# EasyEDA Pro project Xbee_v1.eprj

# Schematic Schematic1

## Sheets
1 Xbee: Board Name: Board1; Create Date: 2024-11-14; Page Name: Xbee; Project Name: Xbee; Schematic Name: Schematic1; Update Date: 2024-11-23; Company: EasyEDA.com; Drawn: EasyEDA; Page Size: A4; Part Number: JLCPCB-002; Reviewed: EasyEDA; Version: V0.1
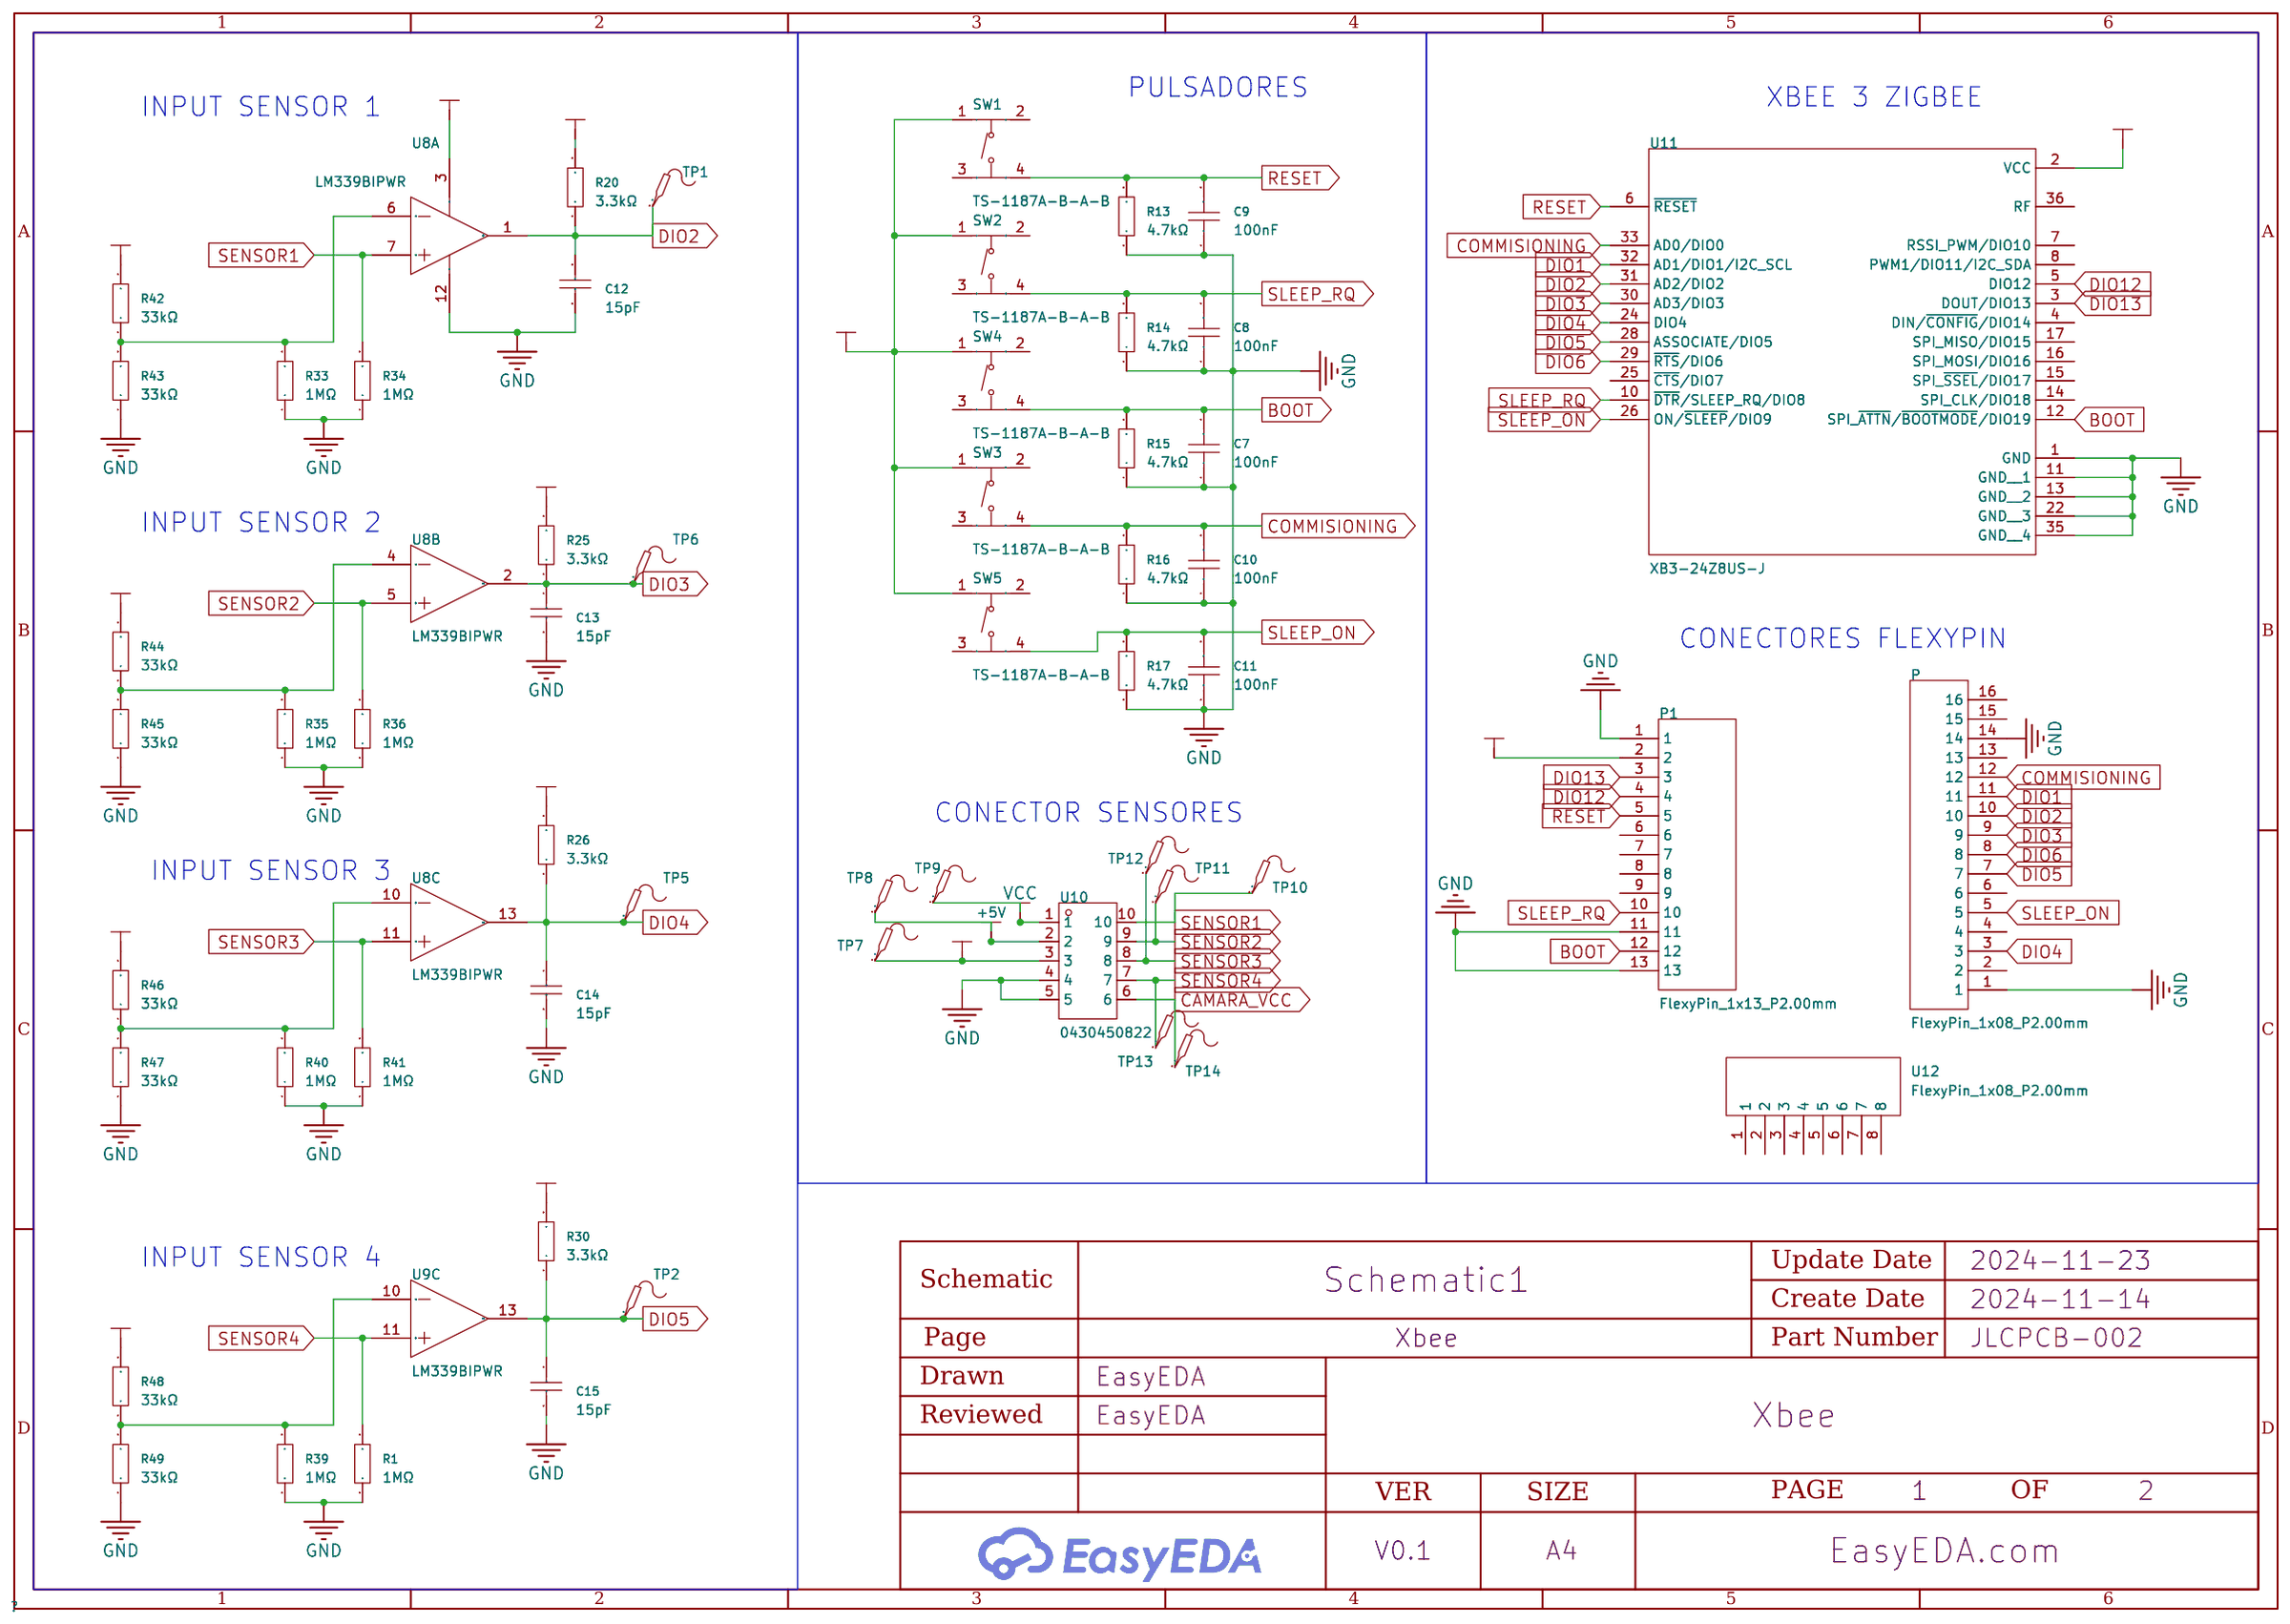
[diagram p0: Xbee]
2 Power: Create Date: 2024-11-18; Page Name: Power
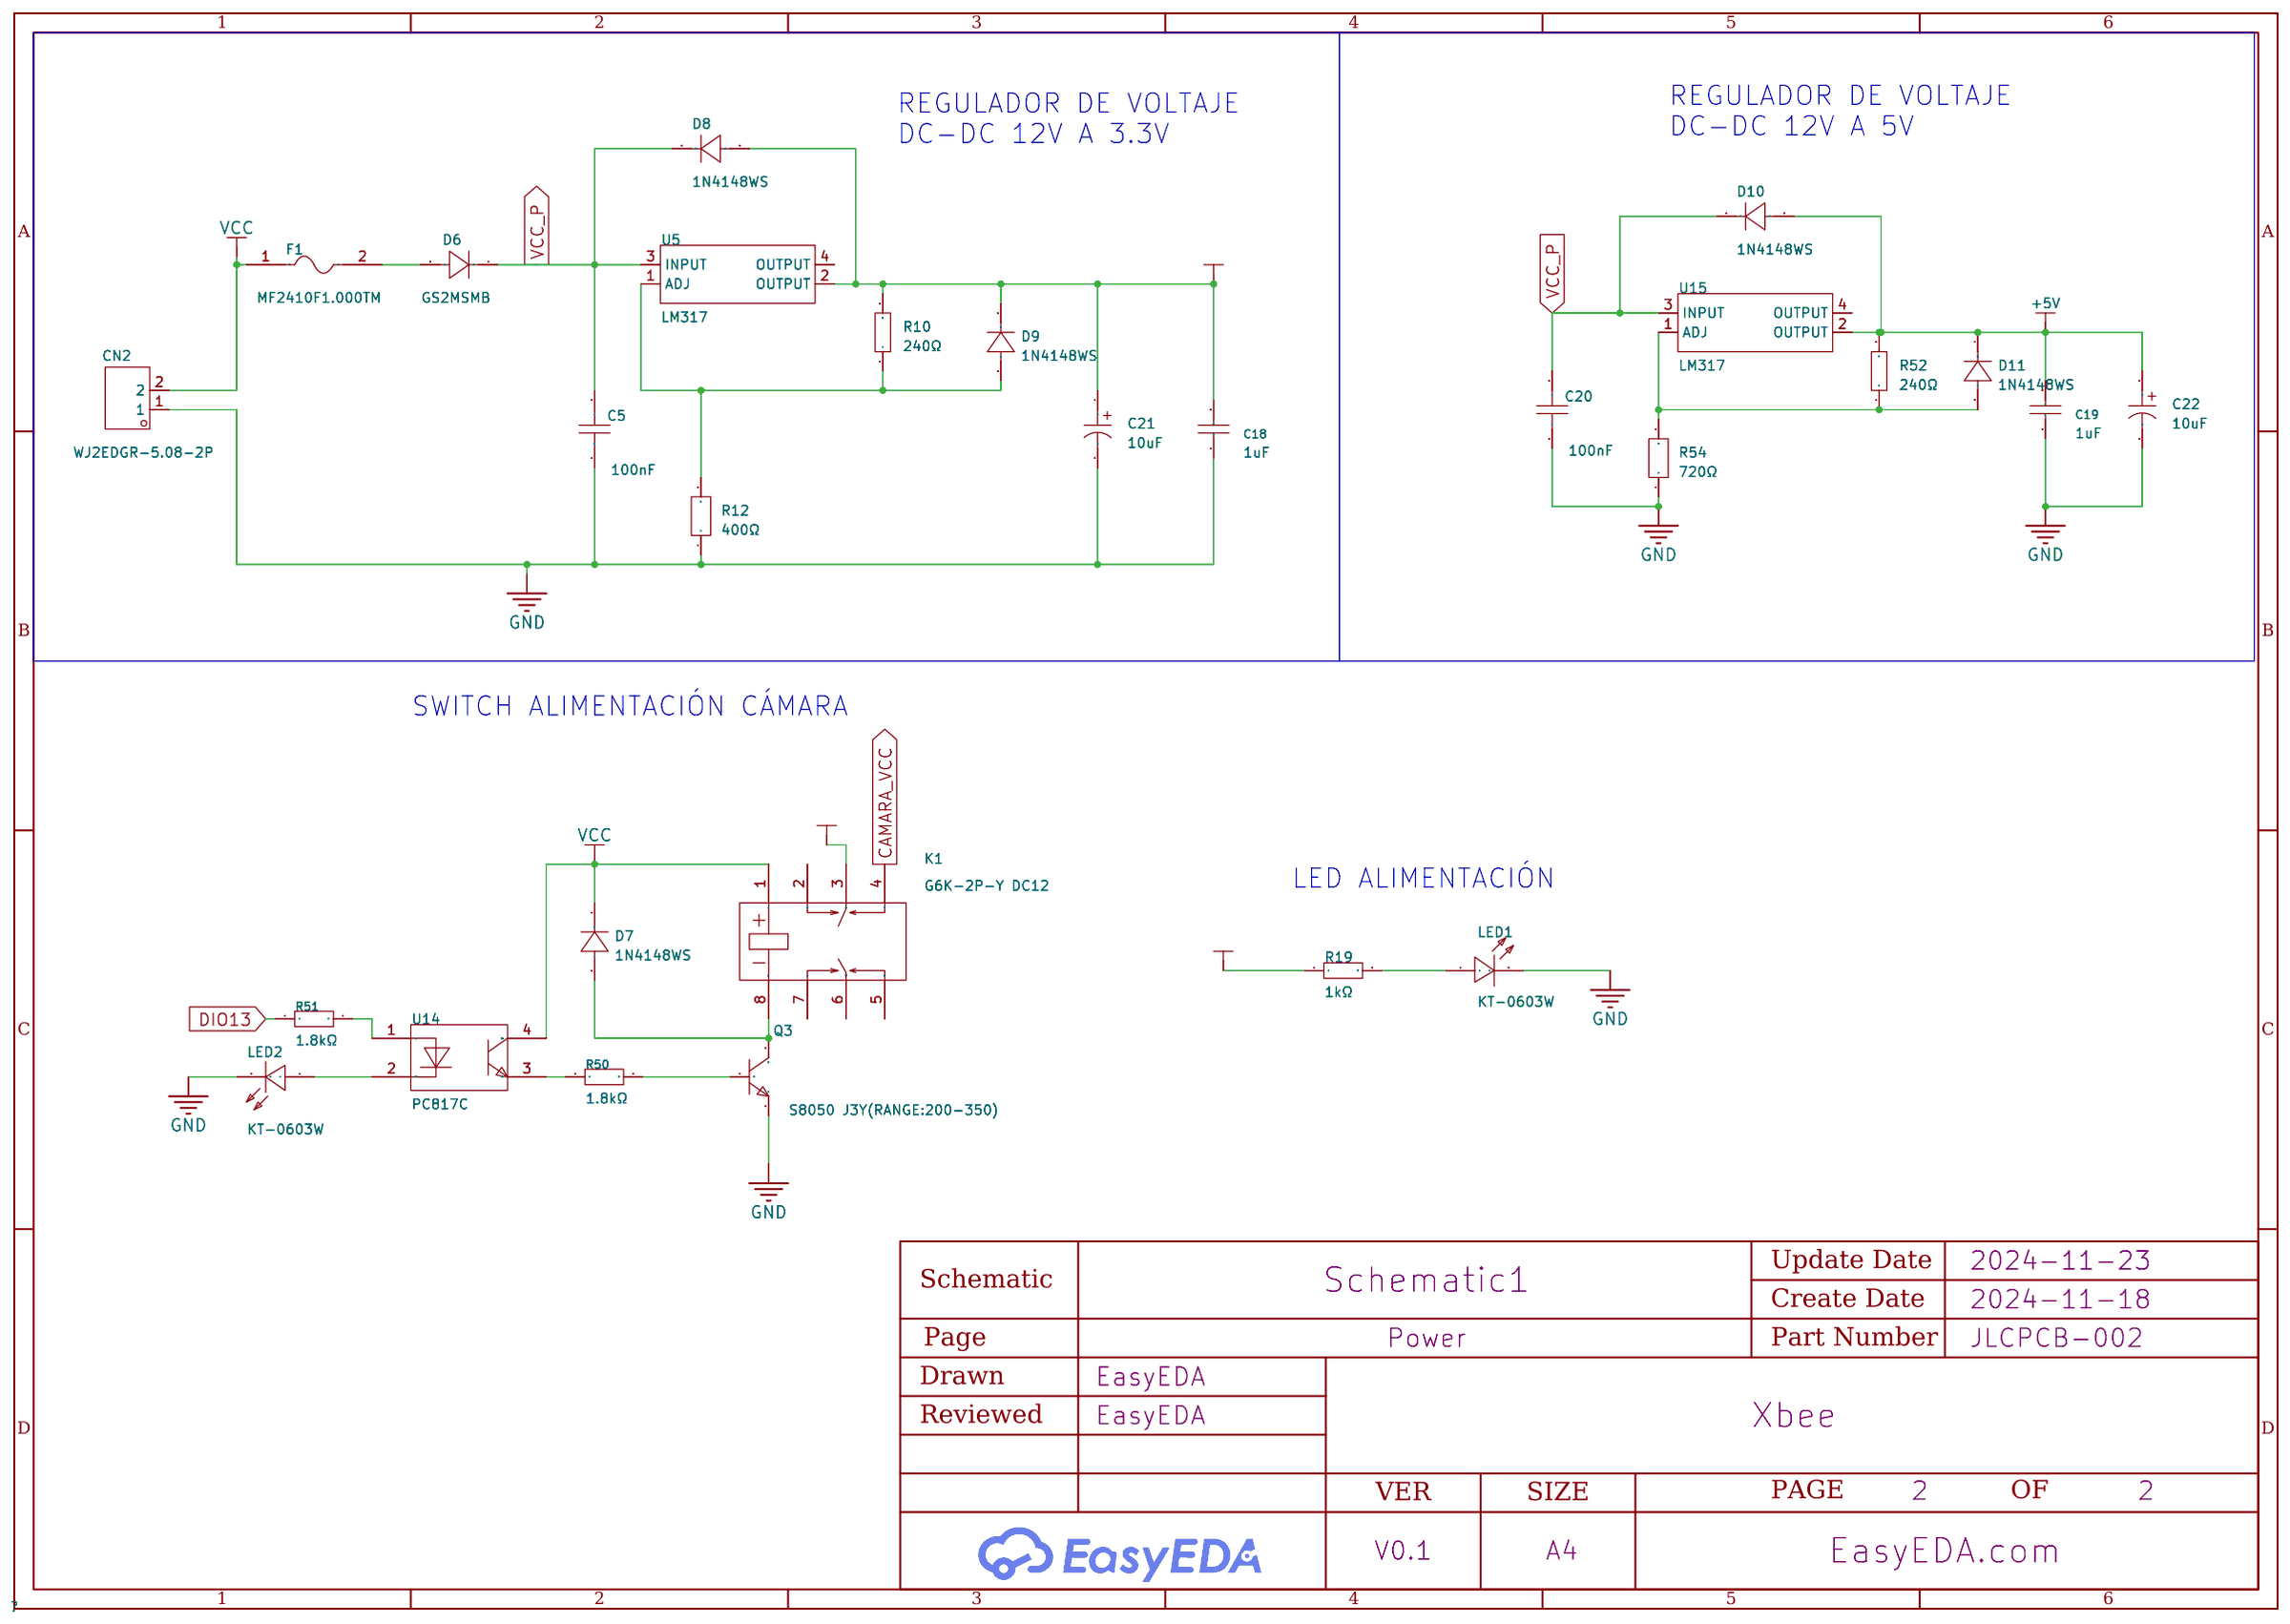
[diagram p1: Power]

## Parts
sheet Power
C5  100nF  [C0603]
C18  1uF  [C0402]
C19  1uF  [C0402]
C20  100nF  [C0603]
C21  10uF  [CAP-TH_BD5.0-P2.00-D0.6-FD]
C22  10uF  [CAP-TH_BD5.0-P2.00-D0.6-FD]
CN2  WJ2EDGR-5.08-2P  [CONN-TH_WJ2EDGR-5.08-2P]
D6  GS2MSMB  [SMB_L4.6-W3.5-LS5.3-RD]
D7  1N4148WS  [SOD-323_L1.8-W1.3-LS2.5-RD]
D8  1N4148WS  [SOD-323_L1.8-W1.3-LS2.5-RD]
D9  1N4148WS  [SOD-323_L1.8-W1.3-LS2.5-RD]
D10  1N4148WS  [SOD-323_L1.8-W1.3-LS2.5-RD]
D11  1N4148WS  [SOD-323_L1.8-W1.3-LS2.5-RD]
F1  MF2410F1.000TM  [F2410]
K1  G6K-2P-Y DC12  [RELAY-TH_6S-2-4.5VG6K-2P-Y-12V]
LED1  KT-0603W  [LED0603-R-RD_WHITE]
LED2  KT-0603W  [LED0603-R-RD_WHITE]
Q3  S8050 J3Y(RANGE:200-350)  [SOT-23-3_L3.0-W1.7-P0.95-LS2.9-BR]
R10  240Ω  [R0402]
R12  400Ω  [R1206]
R19  1kΩ  [R0603]
R50  1.8kΩ  [R0402]
R51  1.8kΩ  [R0402]
R52  240Ω  [R0402]
R54  720Ω  [R0805]
U5  LM317  [SOT-223-3_L6.7-W3.7-P2.30-LS7.0-BR]
U14  PC817C  [SMD-4_L6.5-W4.6-P2.54-LS10.3-TL]
U15  LM317  [SOT-223-3_L6.7-W3.7-P2.30-LS7.0-BR]
sheet Xbee
C7  100nF  [C0603]  (no BOM)
C8  100nF  [C0603]  (no BOM)
C9  100nF  [C0603]  (no BOM)
C10  100nF  [C0603]  (no BOM)
C11  100nF  [C0603]  (no BOM)
C12  15pF  [C0603]
C13  15pF  [C0603]
C14  15pF  [C0603]
C15  15pF  [C0603]
P  FlexyPin_1x08_P2.00mm  [FlexyPin_1x16_P2.00mm]
P1  FlexyPin_1x13_P2.00mm  [FlexyPin_1x13_P2.00mm]
R1  1MΩ  [R1206]
R13  4.7kΩ  [R0805]  (no BOM)
R14  4.7kΩ  [R0805]  (no BOM)
R15  4.7kΩ  [R0805]  (no BOM)
R16  4.7kΩ  [R0805]  (no BOM)
R17  4.7kΩ  [R0805]  (no BOM)
R20  3.3kΩ  [R0603]
R25  3.3kΩ  [R0603]
R26  3.3kΩ  [R0603]
R30  3.3kΩ  [R0603]
R33  1MΩ  [R1206]
R34  1MΩ  [R1206]
R35  1MΩ  [R1206]
R36  1MΩ  [R1206]
R39  1MΩ  [R1206]
R40  1MΩ  [R1206]
R41  1MΩ  [R1206]
R42  33kΩ  [R0603]
R43  33kΩ  [R0603]
R44  33kΩ  [R0603]
R45  33kΩ  [R0603]
R46  33kΩ  [R0603]
R47  33kΩ  [R0603]
R48  33kΩ  [R0603]
R49  33kΩ  [R0603]
SW1  TS-1187A-B-A-B  [SW-SMD_4P-L5.1-W5.1-P3.70-LS6.5-TL_H1.5]  (no BOM)
SW2  TS-1187A-B-A-B  [SW-SMD_4P-L5.1-W5.1-P3.70-LS6.5-TL_H1.5]  (no BOM)
SW3  TS-1187A-B-A-B  [SW-SMD_4P-L5.1-W5.1-P3.70-LS6.5-TL_H1.5]  (no BOM)
SW4  TS-1187A-B-A-B  [SW-SMD_4P-L5.1-W5.1-P3.70-LS6.5-TL_H1.5]  (no BOM)
SW5  TS-1187A-B-A-B  [SW-SMD_4P-L5.1-W5.1-P3.70-LS6.5-TL_H1.5]  (no BOM)
TP1  -  [Test-Point-0.5mm]
TP2  -  [Test-Point-0.5mm]
TP5  -  [Test-Point-0.5mm]
TP6  -  [Test-Point-0.5mm]
TP7  -  [Test-Point-0.5mm]
TP8  -  [Test-Point-0.5mm]
TP9  -  [Test-Point-0.5mm]
TP10  -  [Test-Point-0.5mm]
TP11  -  [Test-Point-0.5mm]
TP12  -  [Test-Point-0.5mm]
TP13  -  [Test-Point-0.5mm]
TP14  -  [Test-Point-0.5mm]
U8  LM339BIPWR  [TSSOP-14_L5.0-W4.4-P0.65-LS6.4-BL]  (sections 1,2,3)
U9  LM339BIPWR  [TSSOP-14_L5.0-W4.4-P0.65-LS6.4-BL]  (section 3)
U10  0430450822  [CONN-TH_0430450822]
U11  XB3-24Z8US-J  [XCVR_XB3-24Z8US-J]  (no BOM)
U12  FlexyPin_1x08_P2.00mm  [FlexyPin_1x08_P2.00mm]

## Library data of the parts
C5 C20 = CC0603KRX7R9BB104: Capacitance: Tolerance:±10% Tolerance:±10% Voltage Rated: Temperature Coefficient:; LCSC Part Name: 100nF ±10% 50V; Supplier Part: C14663; Manufacturer: YAGEO(国巨); Supplier Footprint: 0603; JLCPCB Part Class: Basic Part; Datasheet: https://atta.szlcsc.com/upload/public/pdf/source/20180910/C282072_33301C7F631E79921B82A8DAC6BCC5B3.pdf; Supplier: LCSC; Tolerance: ±10%; Check: true
C18 C19 = CL05A105KP5NNNC: LCSC Part Name: 1uF ±10% 10V; Supplier Part: C14445; Manufacturer: SAMSUNG(三星); Supplier Footprint: 0402; JLCPCB Part Class: Extended Part; Datasheet: https://atta.szlcsc.com/upload/public/pdf/source/20160218/1457707763339.pdf; Supplier: LCSC; Tolerance: ±10%
C21 C22 = 50V10uF CD110: LCSC Part Name: 10uF ±20% 50V; Supplier Part: C2960200; Manufacturer: HRK(鸿瑞凯电子); Supplier Footprint: 插件,D5xL7mm; JLCPCB Part Class: Extended Part; Datasheet: https://atta.szlcsc.com/upload/public/pdf/source/20220224/E11F40A390421459FFAC7D4A6BAF4847.pdf; Supplier: LCSC; Tolerance: ±20%; Operating Temperature: -40℃~+105℃
CN2 = WJ2EDGR-5.08-2P: LCSC Part Name: 1x2P 5.08mm 排数:1 每排P数:2; Supplier Part: C8383; Manufacturer: KANGNEX(康奈克斯电气); Supplier Footprint: 弯插,P=5.08mm; JLCPCB Part Class: Extended Part; Datasheet: https://atta.szlcsc.com/upload/public/pdf/source/20191225/C8383_DE80ABD4B75356B45B295FA186A21D08.pdf; Supplier: LCSC; Connector Type: Board end/socket - Open type; Structure: 1x2P; Pitch: 5.08mm; Color: Green; Mounting Style: Bend; Number of Pins: 2P; Number of Rows: 1; Number of PINs Per Row: 2; Current Rating (Max): 20A; Voltage Rating (Max): 450V; Contact Material: Brass; Contact Plating: Tin; Operating Temperature Range: -40℃~+105℃; Check: true
D6 = GS2MSMB: LCSC Part Name: 电压:1kV 电流:2A; Supplier Part: C2972763; Manufacturer: JKSEMI(金开盛); Supplier Footprint: SMB; JLCPCB Part Class: Extended Part; Datasheet: https://atta.szlcsc.com/upload/public/pdf/source/20220309/99C0AE0C19ED4A75EB02FB7BED855B59.pdf; Supplier: LCSC; Forward Voltage (Vf@If): 1.1V@2A; Check: true
D7-D11 = 1N4148WS_C917117: LCSC Part Name: 电压:100V 电流:300mA; Supplier Part: C917117; Manufacturer: JSMSEMI(杰盛微); Supplier Footprint: SOD-323; JLCPCB Part Class: Extended Part; Datasheet: https://atta.szlcsc.com/upload/public/pdf/source/20230807/08D9F448A82EA88A23B325A669586A09.pdf; Supplier: LCSC; Forward Voltage (Vf@If): 1.25V@150mA; Reverse Leakage Current: 1uA@75V; Operating Temperature: -55℃~+150℃@(Tj)
F1 = MF2410F1.000TM: LCSC Part Name: 250V贴片式保险丝; Supplier Part: C83798; Manufacturer: AEM; Supplier Footprint: SMD; JLCPCB Part Class: Extended Part; Datasheet: https://atta.szlcsc.com/upload/public/pdf/source/20200908/C83798_396F0CF7AA83E8B3AAA489356853D9D1.pdf; Supplier: LCSC; Type: SMD Fuse; Current Rating: 1A; Voltage Rating  (AC): 250V; Operating Temperature: -55℃~+125℃; Breaking Capacity: 100A
K1 = G6K-2P-Y DC12: LCSC Part Name: G6K-2P-Y-12V; Supplier Part: C132367; Manufacturer: OMRON(欧姆龙); Supplier Footprint: DIP,6.5x10mm; JLCPCB Part Class: Extended Part; Datasheet: https://atta.szlcsc.com/upload/public/pdf/source/20220125/C1876770_53E5491D4B68F29C4BBD8118E9BAE0E8.pdf; Supplier: LCSC; Coil Voltage: 12V; Contact Form: 两组转换:2C(DPDT-转换); Maximum Switching Voltage: 125V@AC；60V@DC; Contact Material: silver+Gold plating; Maximum Switching Current: 1A; Operate Time: 3ms; Release Time: 3ms; Operating Temperature: -40℃~+70℃
LED1 LED2 = KT-0603W: LCSC Part Name: 0603 白灯 高亮; Supplier Part: C2290; Manufacturer: KENTO; Supplier Footprint: 0603; JLCPCB Part Class: Basic Part; Datasheet: https://atta.szlcsc.com/upload/public/pdf/source/20221101/4C23D5C85BA051E44A00B833D0A41468.pdf; Supplier: LCSC; Emitted Color: White
Q3 = S8050 J3Y(RANGE:200-350): LCSC Part Name: NPN 电流:500mA 耐压:25V H档(200-350); Supplier Part: C2146; Manufacturer: CJ(江苏长电/长晶); Supplier Footprint: SOT-23; JLCPCB Part Class: Basic Part; Datasheet: https://atta.szlcsc.com/upload/public/pdf/source/20231013/FF37B6A000E6CDA75C9C999D2E78731F.pdf; Supplier: LCSC; DC Current Gain (hFE@Ic,Vce): 200@500mA,1V; Transition Frequency (fT): 150MHz; Collector Cut-Off Current (Icbo): 100nA; Collector-Emitter Saturation Voltage (VCE(sat)@Ic,Ib): 600mV@500mA,50mA; Operating Temperature: -55℃~+150℃
R10 R52 = RC0402FR-07240RL: LCSC Part Name: 厚膜电阻 240Ω ±1% 62.5mW; Supplier Part: C114755; Manufacturer: YAGEO(国巨); Supplier Footprint: 0402; JLCPCB Part Class: Extended Part; Datasheet: https://atta.szlcsc.com/upload/public/pdf/source/20180821/C275644_0D56F95EFF785E7D9A1FEF436B37DA78.pdf; Supplier: LCSC; Type: Thick Film Resistors; Tolerance: ±1%; Temperature Coefficient: ±100ppm/℃; Operating Temperature Range: -55℃~+155℃; Check: true
R12 = RT1206BRD07400RL: LCSC Part Name: 薄膜电阻 400Ω ±0.1% 250mW; Supplier Part: C706413; Manufacturer: YAGEO(国巨); Supplier Footprint: 1206; JLCPCB Part Class: Extended Part; Datasheet: https://atta.szlcsc.com/upload/public/pdf/source/20200720/C706413_991262FD379FFE926945677BBC00C1EC.pdf; Supplier: LCSC; Type: Thin Film Resistor; Tolerance: ±0.1%; Power(Watts): 250mW; Temperature Coefficient: ±25ppm/℃; Operating Temperature Range: -55℃~+155℃; Check: true
R19 = 0603WAF1001T5E: LCSC Part Name: 1kΩ ±1% 100mW 厚膜电阻; Supplier Part: C21190; Manufacturer: UNI-ROYAL(厚声); Supplier Footprint: 0603; JLCPCB Part Class: Basic Part; Datasheet: https://atta.szlcsc.com/upload/public/pdf/source/20200306/C422600_1E6D84923E4A46A82E41ADD87F860B5C.pdf; Supplier: LCSC; Type: Thick Film Resistors; Tolerance: ±1%; Temperature Coefficient: ±100ppm/℃; Operating Temperature Range: -55℃~+155℃
R50 R51 = 0402WGF1801TCE: LCSC Part Name: 1.8kΩ ±1% 62.5mW 厚膜电阻; Supplier Part: C25871; Manufacturer: UNI-ROYAL(厚声); Supplier Footprint: 0402; JLCPCB Part Class: Extended Part; Datasheet: https://atta.szlcsc.com/upload/public/pdf/source/20200306/C422600_1E6D84923E4A46A82E41ADD87F860B5C.pdf; Supplier: LCSC; Type: Thick Film Resistors; Tolerance: ±1%; Temperature Coefficient: ±100ppm/℃; Operating Temperature Range: -55℃~+155℃
R54 = Y1624720R000T9W: LCSC Part Name: 720Ω ±0.01% 200mW; Supplier Part: C4071481; Manufacturer: VISHAY(威世); Supplier Footprint: 0805; JLCPCB Part Class: Extended Part; Supplier: LCSC; Tolerance: ±0.01%; Temperature Coefficient: ±0.2ppm/℃; Operating Temperature Range: -55℃~+150℃
U5 U15 = LM317_C7543014: LCSC Part Name: ADJ 输入40V 输出1.2V~37V 1.5A; Supplier Part: C7543014; Manufacturer: HXY MOSFET(华轩阳电子); Supplier Footprint: SOT-223; JLCPCB Part Class: Extended Part; Datasheet: https://atta.szlcsc.com/upload/public/pdf/source/20240523/5EE7B31F0BBF1ABA5627560C7CA7F030.pdf; Supplier: LCSC; Output Type: 可调; Maximum Input Voltage: 40V; Output Voltage: 1.2V~37V; MAX Output Current: 2.2A; Output Polarity: Positive electrode; Number of Outputs: 1; Check: true
U14 = PC817C_C5451663: LCSC Part Name: 光电晶体管输出 C档 C档; Supplier Part: C5451663; Manufacturer: HXY MOSFET(华轩阳电子); Supplier Footprint: SMD-4; JLCPCB Part Class: Extended Part; Datasheet: https://atta.szlcsc.com/upload/public/pdf/source/20230427/2D3E47F01143E2C21095E32F53157FE2.pdf; Supplier: LCSC; Input voltage type: DC; Output Type: 光电三极管; Forward Voltage: 1.2V; Output Current: 50mA; Reverse Voltage: 6V; Receiving End Voltage: 35V; Number of Outputs: 1; Collector-Emitter Saturation Voltage (Vce(sat)@Ic,IF): 200mV; Rise time: 18us; Fall time: 18us
C7-C11 = CC0603KRX7R9BB104: LCSC Part Name: 100nF ±10% 50V; Supplier Part: C14663; Manufacturer: YAGEO(国巨); Supplier Footprint: 0603; JLCPCB Part Class: Basic Part; Datasheet: https://atta.szlcsc.com/upload/public/pdf/source/20180910/C282072_33301C7F631E79921B82A8DAC6BCC5B3.pdf; Supplier: LCSC; Tolerance: ±10%; Check: true
C12-C15 = CC0603JRNPO9BN150: LCSC Part Name: 15pF ±5% 50V; Supplier Part: C107037; Manufacturer: YAGEO(国巨); Supplier Footprint: 0603; JLCPCB Part Class: Extended Part; Datasheet: https://atta.szlcsc.com/upload/public/pdf/source/20170914/C128857_1505359892143968080.pdf; Supplier: LCSC; Tolerance: ±5%
P = FlexyPin_1x16_P2.00mm: Check: false
P1 = FlexyPin_1x13_P2.00mm: Check: false
R1 R33-R36 R39-R41 = 1206W4F1004T5E: LCSC Part Name: 1MΩ ±1% 250mW 厚膜电阻; Supplier Part: C17927; Manufacturer: UNI-ROYAL(厚声); Supplier Footprint: 1206; JLCPCB Part Class: Basic Part; Datasheet: https://atta.szlcsc.com/upload/public/pdf/source/20200306/C422600_1E6D84923E4A46A82E41ADD87F860B5C.pdf; Supplier: LCSC; Type: Thick Film Resistors; Tolerance: ±1%; Temperature Coefficient: ±100ppm/℃; Operating Temperature Range: -55℃~+155℃
R13-R17 = 0805W8F4701T5E: LCSC Part Name: 4.7kΩ ±1% 125mW 厚膜电阻; Supplier Part: C17673; Manufacturer: UNI-ROYAL(厚声); Supplier Footprint: 0805; JLCPCB Part Class: Basic Part; Datasheet: https://atta.szlcsc.com/upload/public/pdf/source/20200306/C422600_1E6D84923E4A46A82E41ADD87F860B5C.pdf; Supplier: LCSC; Type: Thick Film Resistors; Tolerance: ±1%; Temperature Coefficient: ±100ppm/℃; Operating Temperature Range: -55℃~+155℃
R20 R25 R26 R30 = 0603WAF3301T5E: LCSC Part Name: 3.3kΩ ±1% 100mW 厚膜电阻; Supplier Part: C22978; Manufacturer: UNI-ROYAL(厚声); Supplier Footprint: 0603; JLCPCB Part Class: Basic Part; Datasheet: https://atta.szlcsc.com/upload/public/pdf/source/20200306/C422600_1E6D84923E4A46A82E41ADD87F860B5C.pdf; Supplier: LCSC; Type: Thick Film Resistors; Tolerance: ±1%; Temperature Coefficient: ±100ppm/℃; Operating Temperature Range: -55℃~+155℃
R42-R49 = 0603WAF3302T5E: LCSC Part Name: 33kΩ ±1% 100mW 厚膜电阻; Supplier Part: C4216; Manufacturer: UNI-ROYAL(厚声); Supplier Footprint: 0603; JLCPCB Part Class: Basic Part; Datasheet: https://atta.szlcsc.com/upload/public/pdf/source/20200306/C422600_1E6D84923E4A46A82E41ADD87F860B5C.pdf; Supplier: LCSC; Type: Thick Film Resistors; Tolerance: ±1%; Temperature Coefficient: ±100ppm/℃; Operating Temperature Range: -55℃~+155℃
SW1-SW5 = TS-1187A-B-A-B: LCSC Part Name: 5.1*5.1*1.5mm 立贴 轻触开关; Supplier Part: C318884; Manufacturer: XKB Connectivity(中国星坤); Supplier Footprint: SMD; JLCPCB Part Class: Basic Part; Datasheet: https://atta.szlcsc.com/upload/public/pdf/source/20200227/C318890_053E50208A88A7BA1965D8746000774E.pdf; Supplier: LCSC; Circuit: SPST; Actuator Style: Round Button; Operating Force: 160gf; Mounting Style: Brick nogging; Switch Length: 5.1mm; Switch Width: 5.1mm; Switch Height: 1.5mm; Strike Gundam: 不带; Contact Current: 50mA; Voltage Rating (DC): 12V; Actuator/Cap Color: 金色; With Lamp: No; Mechanical Life: 10万次; Operating Temperature: -30℃~+85℃; Check: true
TP1 TP2 TP5-TP14 = Test-Point: Check: false
U8 U9 = LM339BIPWR: Supplier Part: C7430196; Manufacturer: TI(德州仪器); Supplier Footprint: TSSOP-14; JLCPCB Part Class: Extended Part; Datasheet: https://atta.szlcsc.com/upload/public/pdf/source/20230810/1B1BCF8EE7E9C6AF73251D1269C27114.pdf; Supplier: LCSC
U10 = 0430450822: LCSC Part Name: 2x4P 间距:3mm 弯插 系列:Micro-Fit(MX 3.0); Supplier Part: C17304087; Manufacturer: MOLEX; Supplier Footprint: 弯插; JLCPCB Part Class: Extended Part; Supplier: LCSC; Pins Structure: 2x4P; Pitch: 3mm; Mounting Style: Bend insert; Reference Series: Micro-Fit(MX 3.0); Number of Pins: 8P; Number of Rows: 2; Number of PINs Per Row: 4; Row Spacing: 3mm; Current Rating (Max): 8.5A; Contact Material: Brass; Contact Plating: Gold; Operating Temperature Range: -40℃~+105℃; Rated Voltage (Max): 600V; Flame Retardant Rating: UL94V-0; Supplementary Features: Harpoon foot (metal)；Auxiliary soldering legs; Colour: Black; Z-Height of the Board: 8.8mm; X-Length of Bottom Edge on Board (Spacing Line): 15.65mm; Y-Width of Bottom Edge on Board: 12.24mm
U11 = XB3-24Z8US-J
U12 = FlexyPin_1x08_P2.00mm: Check: false

## Nets
+3.3V: C18.2 C21.1 D8.2(A) D9.1(C) K1.3 P1.2 R10.2 R19.1 R20.2 R25.2 R26.2 R30.2 R42.2 R44.2 R46.2 R48.2 SW1.1(A) SW2.1(A) SW3.1(A) SW4.1(A) SW5.1(A) TP7.1 U5.2(OUTPUT) U8.3(VCC) U10.3 U11.2(VCC)
+5V: C19.2 C22.1 D10.2(A) D11.1(C) R52.2 TP8.1 U10.2 U15.2(OUTPUT)
GND: C5.1 C7.1 C8.1 C9.1 C10.1 C11.1 C12.2 C13.2 C14.2 C15.2 C18.1 C19.1 C20.1 C21.2 C22.2 CN2.1 LED1.2(K) LED2.2(K) P.1 P.14 P1.1 P1.11 P1.13 Q3.2(E) R1.1 R12.1 R13.1 R14.1 R15.1 R16.1 R17.1 R33.1 R34.1 R35.1 R36.1 R39.1 R40.1 R41.1 R43.1 R45.1 R47.1 R49.1 R54.1 U8.12(GND) U10.4 U10.5 U11.1(GND) U11.11(GND__1) U11.13(GND__2) U11.22(GND__3) U11.35(GND__4)
VCC: CN2.2 D7.1(C) F1.1 K1.1 TP9.1 U10.1 U14.4(Collector)
VCC_P: C5.2 C20.2 D6.1(C) D8.1(C) D10.1(C) U5.3(INPUT) U15.3(INPUT)
BOOT: C7.2 P1.12 R15.2 SW4.4(D) U11.12(SPI_~{ATTN}/~{BOOTMODE}/DIO19)
CAMARA_VCC: K1.4 TP14.1 U10.6
COMMISIONING: C10.2 P.12 R16.2 SW3.4(D) U11.33(AD0/DIO0)
DIO1: P.11 U11.32(AD1/DIO1/I2C_SCL)
DIO2: C12.1 P.10 R20.1 TP1.1 U8.1(OUT1) U11.31(AD2/DIO2)
DIO3: C13.1 P.9 R25.1 TP6.1 U8.2(OUT2) U11.30(AD3/DIO3)
DIO4: C14.1 P.3 R26.1 TP5.1 U8.13(OUT3) U11.24(DIO4)
DIO5: C15.1 P.7 R30.1 TP2.1 U9.13(OUT3) U11.28(ASSOCIATE/DIO5)
DIO6: P.8 U11.29(~{RTS}/DIO6)
DIO12: P1.4 U11.5(DIO12)
DIO13: P1.3 R51.1 U11.3(DOUT/DIO13)
RESET: C9.2 P1.5 R13.2 SW1.4(D) U11.6(~{RESET})
SENSOR1: R34.2 TP10.1 U8.7(IN1+) U10.10
SENSOR2: R36.2 TP11.1 U8.5(IN2+) U10.9
SENSOR3: R41.2 TP12.1 U8.11(IN3+) U10.8
SENSOR4: R1.2 TP13.1 U9.11(IN3+) U10.7
SLEEP_ON: C11.2 P.5 R17.2 SW5.4(D) U11.26(ON/~{SLEEP}/DIO9)
SLEEP_RQ: C8.2 P1.10 R14.2 SW2.4(D) U11.10(~{DTR}/SLEEP_RQ/DIO8)
$1N9776: R33.2 R42.1 R43.2 U8.6(IN1-)
$1N10309: R35.2 R44.1 R45.2 U8.4(IN2-)
$1N10678: R40.2 R46.1 R47.2 U8.10(IN3-)
$1N11010: R39.2 R48.1 R49.2 U9.10(IN3-)
$2N484: D9.2(A) R10.1 R12.2 U5.1(ADJ)
$2N770: LED1.1(A) R19.2
$2N3060: R51.2 U14.1(Anode)
$2N3062: Q3.1(B) R50.2
$2N3068: R50.1 U14.3(Emitter)
$2N3229: LED2.1(A) U14.2(Cathode)
$2N3351: D7.2(A) K1.8 Q3.3(C)
$2N4261: D6.2(A) F1.2
$2N4985: D11.2(A) R52.1 R54.2 U15.1(ADJ)

Not connected (* = marked no-connect by the designer): K1 2 5 6 7; P 2 4 6 13 15 16; P1 6 7 8 9; SW1 2(B) 3(C); SW2 2(B) 3(C); SW3 2(B) 3(C); SW4 2(B) 3(C); SW5 2(B) 3(C); U5 4(OUTPUT); U11 4(DIN/~{CONFIG}/DIO14) 7(RSSI_PWM/DIO10) 8(PWM1/DIO11/I2C_SDA) 14(SPI_CLK/DIO18) 15(SPI_~{SSEL}/DIO17) 16(SPI_MOSI/DIO16) 17(SPI_MISO/DIO15) 25(~{CTS}/DIO7) 36(RF); U12 1 2 3 4 5 6 7 8; U15 4(OUTPUT)

## Notes on the sheets
sheet 1
- PULSADORES
- XBEE 3 ZIGBEE
- INPUT SENSOR 1
- INPUT SENSOR 2
- CONECTORES FLEXYPIN
- CONECTOR SENSORES
- INPUT SENSOR 3
- INPUT SENSOR 4
sheet 2
- REGULADOR DE VOLTAJE
  DC-DC 12V A 3.3V
- REGULADOR DE VOLTAJE
  DC-DC 12V A 5V
- SWITCH ALIMENTACIÓN CÁMARA
- LED ALIMENTACIÓN

# Board PCB1
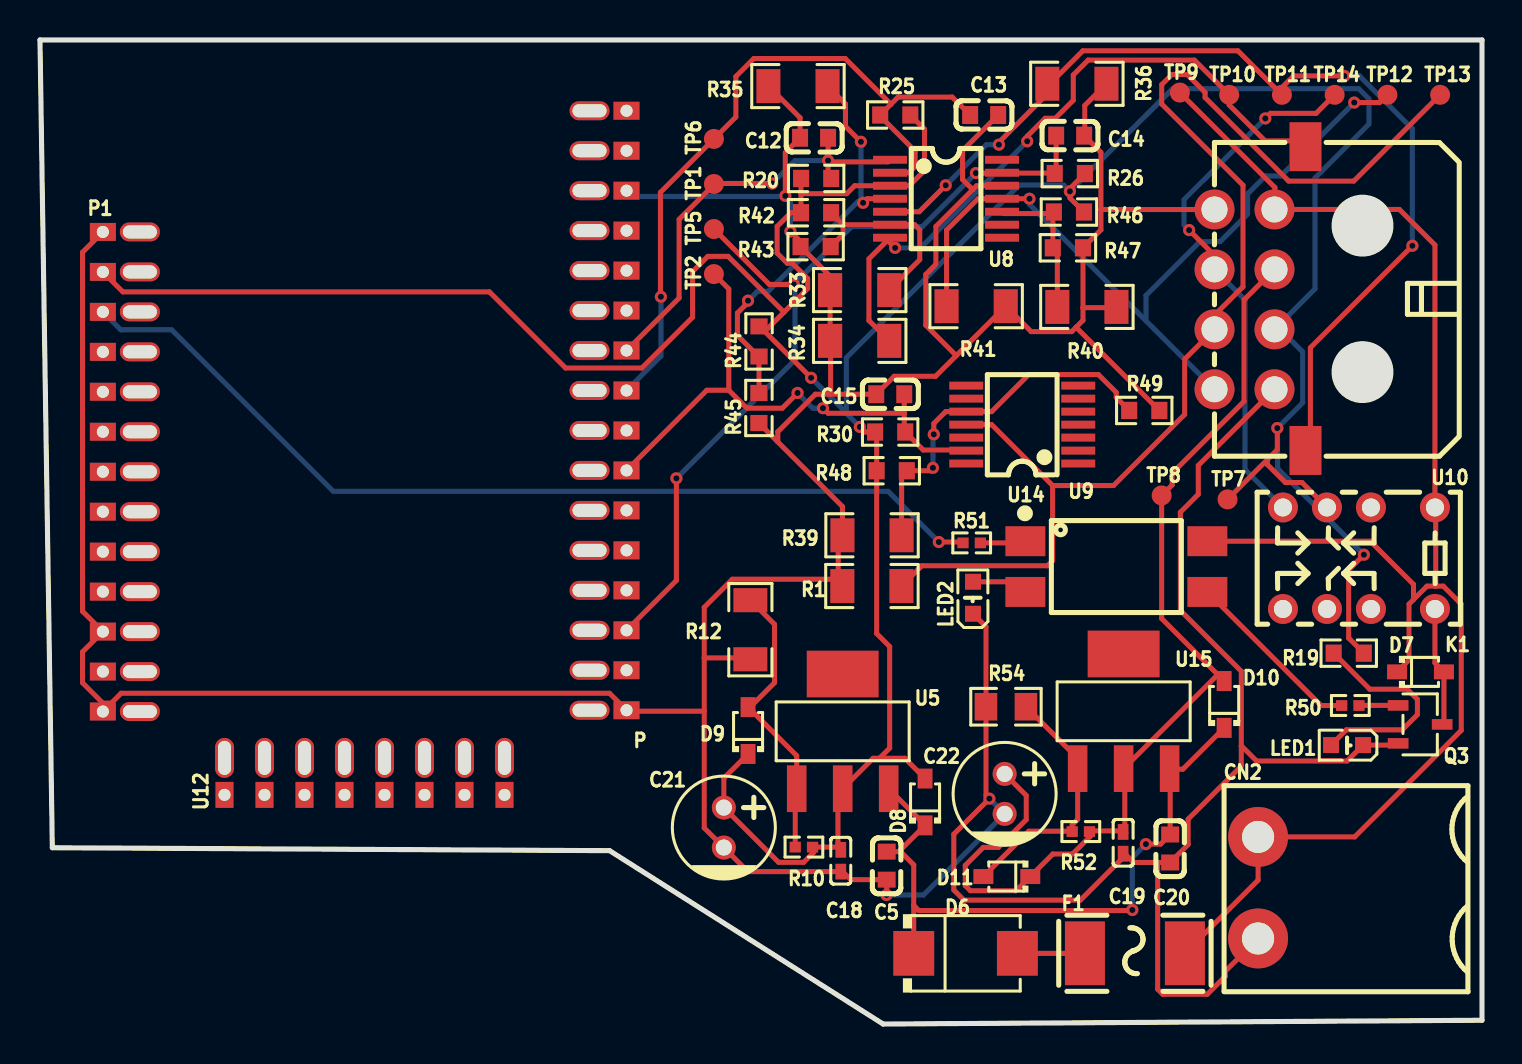
[diagram p2: board, top side]
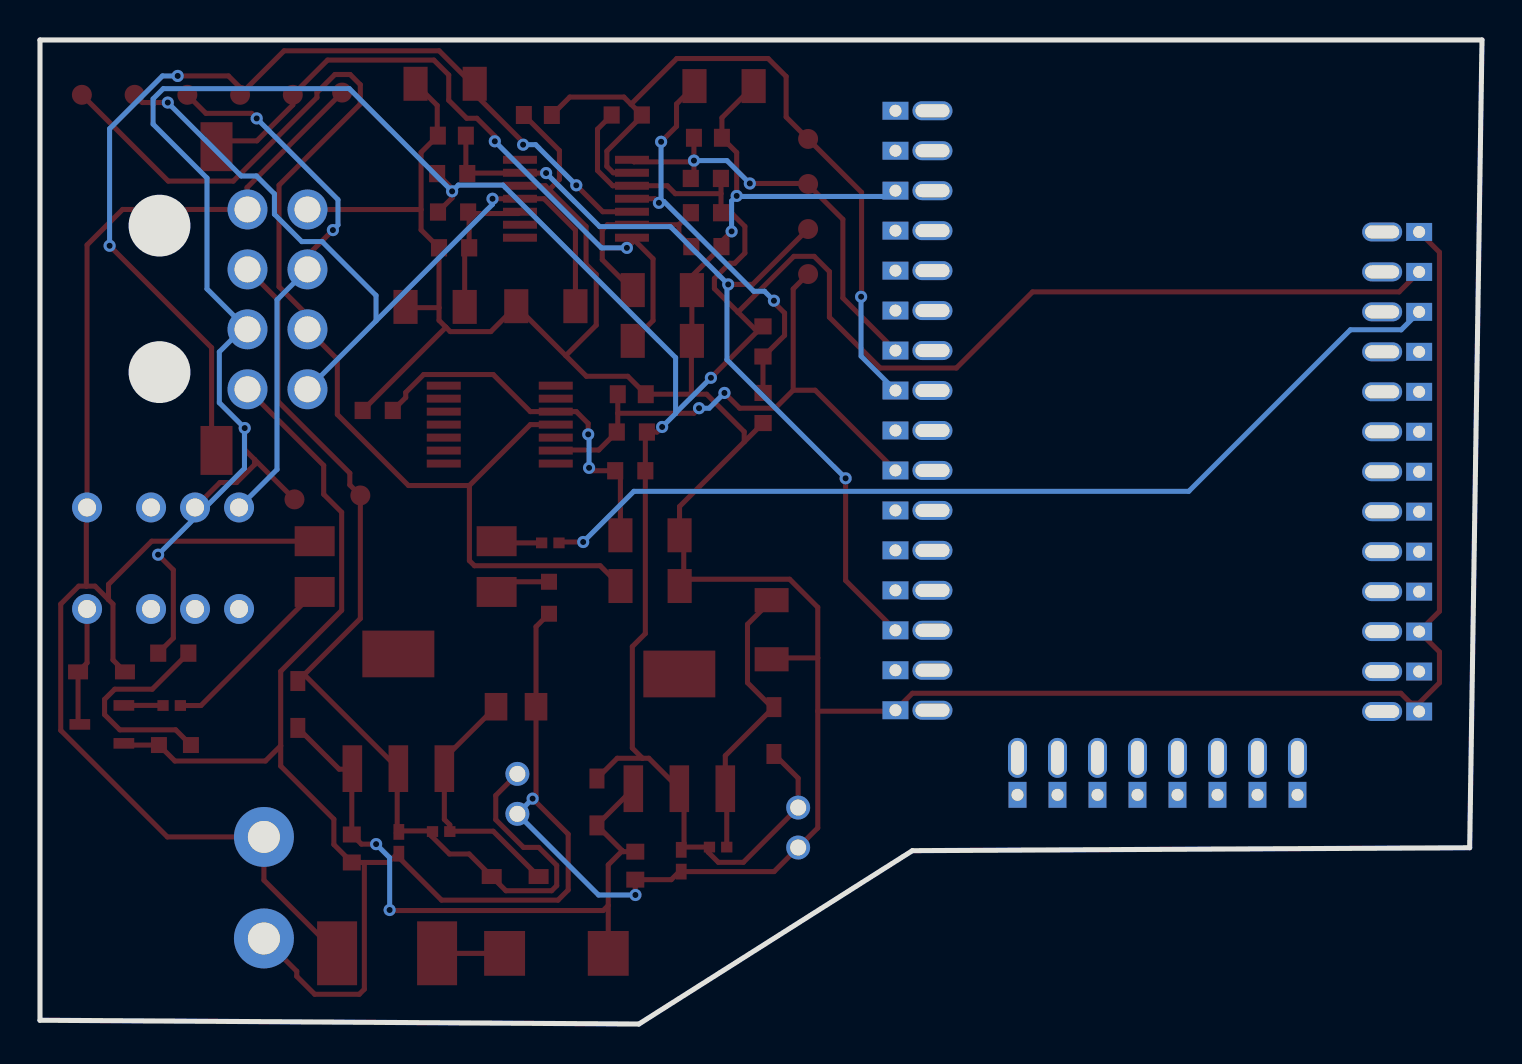
[diagram p3: board, bottom side, seen from below]

Outline 72.11 x 49.25 mm; copper layers: Top Layer, Bottom Layer. Coordinates in mm from the lower left corner of the outline.
Outline path: 0,49.25 72.11,49.25 72.11,0.19 42.16,0 28.48,8.68 0.62,8.82 0,49.25
Stack: Top Layer 0.035mm / Dielectric1 1.51mm FR4 er 4.5 / Bottom Layer 0.035mm

## Design rules (mm)
template: Custom Config
spacing copperThickness1oz: track to track 0.102, other pairs 0.152 to 0.3
spacing copperThickness2oz (default): track to track 0.102, other pairs 0.152 to 0.3
track width copperThickness1oz (default): min 0.127, default 0.254, max 2.54
track width copperThickness2oz: min 0.203, default 0.254, max 2.54
differential pair differentialPair (default): width min 0.127, default 0.254, max 2.54; gap min 0.152, default 0.152
via viaSize (default): diameter min 0.5, default 0.61, max 10; hole min 0.3, default 0.305, max 6.3

## Placement (name value [footprint] x y rotation side)
C5  100nF  [C0603]  42.34 7.93 90 top
C12  15pF  [C0603]  38.71 44.35 180 top
C13  15pF  [C0603]  47.21 45.49 0 top
C14  15pF  [C0603]  51.51 44.46 0 top
C15  15pF  [C0603]  42.52 31.52 180 top
C18  1uF  [C0402]  40.04 8.17 90 top
C19  1uF  [C0402]  54.16 9.07 90 top
C20  100nF  [C0603]  56.51 8.79 90 top
C21  10uF  [CAP-TH_BD5.0-P2.00-D0.6-FD]  34.2 9.83 270 top
C22  10uF  [CAP-TH_BD5.0-P2.00-D0.6-FD]  48.23 11.52 270 top
CN2  WJ2EDGR-5.08-2P  [CONN-TH_WJ2EDGR-5.08-2P]  60.91 6.82 90 top
D6  GS2MSMB  [SMB_L4.6-W3.5-LS5.3-RD]  46.28 3.54 0 top
D7  1N4148WS  [SOD-323_L1.8-W1.3-LS2.5-RD]  69.03 17.62 0 top
D8  1N4148WS  [SOD-323_L1.8-W1.3-LS2.5-RD]  44.26 11.11 90 top
D9  1N4148WS  [SOD-323_L1.8-W1.3-LS2.5-RD]  35.41 14.69 90 top
D10  1N4148WS  [SOD-323_L1.8-W1.3-LS2.5-RD]  59.21 15.99 90 top
D11  1N4148WS  [SOD-323_L1.8-W1.3-LS2.5-RD]  48.35 7.38 180 top
F1  MF2410F1.000TM  [F2410]  54.75 3.54 180 top
K1  G6K-2P-Y DC12  [RELAY-TH_6S-2-4.5VG6K-2P-Y-12V]  65.95 23.31 180 top
LED1  KT-0603W  [LED0603-R-RD_WHITE]  65.36 13.96 180 top
LED2  KT-0603W  [LED0603-R-RD_WHITE]  46.65 21.33 90 top
P  FlexyPin_1x08_P2.00mm  [FlexyPin_1x16_P2.00mm]  29.03 15.7 180 top
P1  -  [FlexyPin_1x13_P2.00mm]  3.44 39.64 0 top
Q3  S8050 J3Y(RANGE:200-350)  [SOT-23-3_L3.0-W1.7-P0.95-LS2.9-BR]  69.01 15 180 top
R1  1MΩ  [R1206]  41.6 21.92 0 top
R10  240Ω  [R0402]  38.2 8.86 0 top
R12  400Ω  [R1206]  35.52 19.73 90 top
R19  1kΩ  [R0603]  65.44 18.56 180 top
R20  3.3kΩ  [R0603]  38.81 42.32 180 top
R25  3.3kΩ  [R0603]  42.77 45.49 0 top
R26  3.3kΩ  [R0603]  51.49 42.56 0 top
R30  3.3kΩ  [R0603]  42.51 29.63 180 top
R33  1MΩ  [R1206]  40.99 36.73 0 top
R34  1MΩ  [R1206]  40.99 34.19 0 top
R35  1MΩ  [R1206]  37.9 46.94 0 top
R36  1MΩ  [R1206]  51.85 47.05 180 top
R39  1MΩ  [R1206]  41.6 24.46 0 top
R40  1MΩ  [R1206]  52.35 35.89 180 top
R41  1MΩ  [R1206]  46.81 35.92 180 top
R42  33kΩ  [R0603]  38.81 40.6 180 top
R43  33kΩ  [R0603]  38.78 38.9 0 top
R44  33kΩ  [R0603]  35.95 34.16 90 top
R45  33kΩ  [R0603]  35.95 30.83 90 top
R46  33kΩ  [R0603]  51.45 40.64 0 top
R47  33kΩ  [R0603]  51.4 38.85 180 top
R48  33kΩ  [R0603]  42.59 27.69 180 top
R49  33kΩ  [R0603]  55.22 30.71 180 top
R50  1.8kΩ  [R0402]  65.52 15.94 0 top
R51  1.8kΩ  [R0402]  46.59 24.08 0 top
R52  240Ω  [R0402]  52.05 9.63 0 top
R54  720Ω  [R0805]  48.3 15.88 0 top
TP1  -  [Test-Point-0.5mm]  33.7 42.04 90 top
TP2  -  [Test-Point-0.5mm]  33.7 37.53 90 top
TP5  -  [Test-Point-0.5mm]  33.7 39.79 90 top
TP6  -  [Test-Point-0.5mm]  33.7 44.29 90 top
TP7  -  [Test-Point-0.5mm]  59.38 26.26 0 top
TP8  -  [Test-Point-0.5mm]  56.09 26.45 0 top
TP9  -  [Test-Point-0.5mm]  57 46.61 0 top
TP10  -  [Test-Point-0.5mm]  59.46 46.5 0 top
TP11  -  [Test-Point-0.5mm]  62.1 46.5 0 top
TP12  -  [Test-Point-0.5mm]  67.38 46.5 0 top
TP13  -  [Test-Point-0.5mm]  70.01 46.5 0 top
TP14  -  [Test-Point-0.5mm]  64.74 46.5 0 top
U5  LM317  [SOT-223-3_L6.7-W3.7-P2.30-LS7.0-BR]  40.14 14.65 270 top
U8  LM339BIPWR  [TSSOP-14_L5.0-W4.4-P0.65-LS6.4-BL]  45.31 41.3 270 top
U9  LM339BIPWR  [TSSOP-14_L5.0-W4.4-P0.65-LS6.4-BL]  49.12 30 90 top
U10  0430450822  [CONN-TH_0430450822]  61.01 36.31 90 top
U12  -  [FlexyPin_1x08_P2.00mm]  9.23 11.77 90 top
U14  PC817C  [SMD-4_L6.5-W4.6-P2.54-LS10.3-TL]  53.82 22.89 0 top
U15  LM317  [SOT-223-3_L6.7-W3.7-P2.30-LS7.0-BR]  54.19 15.65 270 top

## Footprints (pads in the part's own frame, mm; a bottom-side part is the same pattern mirrored in y, then rotated)
C0402
  rect 0.79x0.54 smd: 1(-0.545,0) 2(0.545,0)
C0603
  rect 0.8x0.9 smd: 1(-0.7,0) 2(0.7,0)
CAP-TH_BD5.0-P2.00-D0.6-FD
  round 1.202 hole 0.801: 1(-1,0) 2(1,0)
CONN-TH_0430450822
  round 2 hole 1.3: 1(4.459,-0.725) 2(1.46,-0.725) 3(-1.54,-0.725) 4(-4.54,-0.725) 5(4.459,2.275) 6(1.46,2.275) 7(-1.54,2.275) 8(-4.54,2.275)
  rect 2.45x1.6 smd: 9(-7.6,-2.275) 10(7.6,-2.275)
CONN-TH_WJ2EDGR-5.08-2P
  round 3 hole 1.6: 1(-2.54,0) 2(2.54,0)
F2410
  rect 2x3.2 smd: 1(-2.5,0) 2(2.5,0)
FlexyPin_1x08_P2.00mm
  oval 2x0.95 hole 1.7x0.65: (1.55,0) (1.55,-2) (1.55,-4) (1.55,-6) (1.55,-8) (1.55,-10) (1.55,-12) (1.55,-14)
  rect 1.3x0.9 hole 0.6: 1(-0.3,0) 2(-0.3,-2) 3(-0.3,-4) 4(-0.3,-6) 5(-0.3,-8) 6(-0.3,-10) 7(-0.3,-12) 8(-0.3,-14)
FlexyPin_1x13_P2.00mm
  oval 2x0.95 hole 1.7x0.65: (1.55,0) (1.55,-2) (1.55,-4) (1.55,-6) (1.55,-8) (1.55,-10) (1.55,-12) (1.55,-14) (1.55,-16) (1.55,-18) (1.55,-20) (1.55,-22) (1.55,-24)
  rect 1.3x0.9 hole 0.6: 1(-0.3,0) 2(-0.3,-2) 3(-0.3,-4) 4(-0.3,-6) 5(-0.3,-8) 6(-0.3,-10) 7(-0.3,-12) 8(-0.3,-14) 9(-0.3,-16) 10(-0.3,-18) 11(-0.3,-20) 12(-0.3,-22) 13(-0.3,-24)
FlexyPin_1x16_P2.00mm
  oval 2x0.95 hole 1.7x0.65: (1.55,0) (1.55,-2) (1.55,-4) (1.55,-6) (1.55,-8) (1.55,-10) (1.55,-12) (1.55,-14) (1.55,-16) (1.55,-18) (1.55,-20) (1.55,-22) (1.55,-24) (1.55,-26) (1.55,-28) (1.55,-30)
  rect 1.3x0.9 hole 0.6: 1(-0.3,0) 2(-0.3,-2) 3(-0.3,-4) 4(-0.3,-6) 5(-0.3,-8) 6(-0.3,-10) 7(-0.3,-12) 8(-0.3,-14) 9(-0.3,-16) 10(-0.3,-18) 11(-0.3,-20) 12(-0.3,-22) 13(-0.3,-24) 14(-0.3,-26) 15(-0.3,-28) 16(-0.3,-30)
LED0603-R-RD_WHITE
  rect 0.8x0.8 smd: 1(0.8,0) 2(-0.8,0)
R0402
  rect 0.566x0.54 smd: 1(-0.433,0) 2(0.433,0)
R0603
  rect 0.806x0.864 smd: 1(-0.753,0) 2(0.753,0)
R0805
  rect 1.133x1.377 smd: 1(-1,0) 2(1,0)
R1206
  rect 1.208x1.701 smd: 1(-1.479,0) 2(1.479,0)
RELAY-TH_6S-2-4.5VG6K-2P-Y-12V
  round 1.5 hole 0.9: 1(-3.8,-2.54) 2(-0.6,-2.54) 3(1.6,-2.54) 4(3.8,-2.54) 5(3.8,2.54) 6(1.6,2.54) 7(-0.6,2.54) 8(-3.8,2.54)
SMB_L4.6-W3.5-LS5.3-RD
  rect 2.047x2.241 smd: 1(-2.591,0) 2(2.591,0)
SMD-4_L6.5-W4.6-P2.54-LS10.3-TL
  rect 2x1.5 smd: 1(-4.55,1.27) 2(-4.55,-1.27) 3(4.55,-1.27) 4(4.55,1.27)
SOD-323_L1.8-W1.3-LS2.5-RD
  rect 1x0.75 smd: 1(-1.173,0) 2(1.173,0)
SOT-23-3_L3.0-W1.7-P0.95-LS2.9-BR
  rect 1.038x0.532 smd: 1(1.101,-0.95) 2(1.101,0.95) 3(-1.101,0)
SOT-223-3_L6.7-W3.7-P2.30-LS7.0-BR
  rect 2.34x0.98 smd: 1(2.87,-2.3) 2(2.87,0) 3(2.87,2.3)
  rect 2.34x3.6 smd: 4(-2.87,0)
Test-Point-0.5mm
  round 1 smd: 1(0,0)
TSSOP-14_L5.0-W4.4-P0.65-LS6.4-BL
  rect 0.4x1.7 smd: 1(-1.95,-2.8) 2(-1.3,-2.8) 3(-0.65,-2.8) 4(0,-2.8) 5(0.65,-2.8) 6(1.3,-2.8) 7(1.95,-2.8) 8(1.95,2.8) 9(1.3,2.8) 10(0.65,2.8) 11(0,2.8) 12(-0.65,2.8) 13(-1.3,2.8) 14(-1.95,2.8)

## Nets
As in the schematic.

Pads without a net: K1 2 5 6 7; P 2 4 6 13 15 16; P1 6 7 8 9; U5 4; U8 8 9 14; U9 1 2 3 4 5 6 7 8 9 12 14; U12 1 2 3 4 5 6 7 8; U15 4

## Via types
v1: diameter 0.61, hole 0.305, Top Layer to Bottom Layer, 35 vias

## Routing (per net, layer and track width the routed paths; a pad name or vN(x,y) marks a point on that pad's centre or on a via; arc(x,y) is an arc through that point)
+3.3V: length 184.1
  Top Layer w0.254: K1.3 63.11,27.1 62.27,27.1 61.38,28 61.38,28.25 ; 38.05,41.55 40.34,41.55 40.74,41.95 43.47,41.95 44.23,42.71 44.23,44.78 R25.2 ; 38.05,41.55 R42.2 37.54,40.6 36.86,39.91 36.86,38.58 37.37,38.07 37.62,38.07 38.38,37.31 38.38,36.8 37.2,35.62 ; 38.05,41.55 38.05,42.31 ; 38.69,8.86 39.9,8.86 ; 38.69,8.86 R10.2 ; 38.69,8.86 38.69,8.6 38.19,8.09 36.93,8.09 C21.1 34.2,12.3 D9.1 ; 39.9,8.86 40,8.86 40.13,8.73 ; 39.9,8.86 39.9,11.54 41.66,13.3 41.98,13.3 ; 61.38,28.25 TP7.1 ; 61.38,28.25 61.87,28.74 v1(61.87,29.82) ; R19.1 65.44,19.32 65.44,22.73 v1(66.2,23.49) ; 41.98,13.3 42.49,13.81 42.49,18.89 41.84,19.54 R48.2 41.84,29.55 R30.2 41.25,29.63 v1(41,29.88) ; 41.98,13.3 43.24,13.3 D8.2 ; 36.13,34.77 36.1,34.77 R44.2 ; 36.13,34.77 v1(38.56,32.34) ; 36.13,34.77 36.35,34.77 37.2,35.62 ; R26.2 51.5,41.81 v1(51.5,41.67) 51.5,41.34 52.2,40.64 ; P1.2 4.14,36.64 22.47,36.64 26.28,32.83 30.09,32.83 32.63,35.37 32.63,37.66 33.39,38.42 34.41,38.42 37.2,35.62
  Bottom Layer w0.254: 61.88,29.84 v1(61.87,29.82) ; 61.88,29.84 63.14,31.09 63.14,33.63 61.87,34.9 ; 61.88,29.84 61.88,27.81 v1(66.2,23.49) ; 61.87,34.9 63.76,36.79 63.76,42.34 66.45,45.03 66.45,46.3 65.94,46.81 56.64,46.81 v1(51.5,41.67) 51.19,41.98 48.96,41.98 40.32,33.35 40.32,30.58 ; 61.87,34.9 U10.3 ; 40.32,30.58 40.32,30.55 v1(41,29.88) ; 40.32,30.58 v1(38.56,32.34)
+5V: length 51.5
  Top Layer w0.254: C22.1 49.32,11.44 49.32,10.23 47.93,8.84 47.17,8.84 46.27,7.94 46.27,6.92 46.52,6.67 48.81,6.67 D11.1 50.65,8.51 51.63,8.51 52.53,9.41 52.53,9.66 ; 58.92,17.46 58.87,17.46 54.24,12.84 ; 58.92,17.46 D10.2 ; 58.92,17.46 56.09,20.29 TP8.1 56.61,26.98 56.61,27.57 60.21,31.16 60.21,36.24 U10.2 ; 52.53,9.66 52.51,9.66 R52.2 ; 52.53,9.66 54.24,9.66 ; 54.24,9.66 54.24,9.61 54.3,9.56 ; 54.24,9.66 54.24,12.84 ; 54.24,12.84 U15.2
GND: length 270.6
  Top Layer w0.254: 61.73,31.77 57.92,27.95 57.92,26.51 57.02,25.61 57.02,20.7 60.07,17.65 60.07,13.93 ; 51.82,34.88 52.15,35.21 52.15,35.85 ; 51.82,34.88 51.59,34.65 49.56,34.65 R41.1 45.82,33.45 ; 51.82,34.88 51.82,34.86 R49.1 ; CN2.1 59.27,2.64 59.27,2.39 58.37,1.49 56.14,1.49 55.89,1.74 55.89,8.08 ; 33.21,15.66 33.21,9.81 C21.2 35.4,7.63 40.14,7.63 ; 33.21,15.66 33.21,18.32 ; 33.21,15.66 29.38,15.66 28.48,16.55 4.06,16.55 3.56,16.06 ; 46.64,41.76 46.13,42.26 46.13,43.71 C13.2 ; 46.64,41.76 44.8,39.91 44.8,38.02 44.29,37.51 44.29,34.97 45.82,33.45 ; 46.64,41.76 46.84,41.95 U8.12 ; 67.91,14.05 67.83,13.96 LED1.2 65.36,13.16 60.83,13.16 60.07,13.93 ; 3.56,16.06 P1.13 ; 3.56,16.06 3.14,16.06 2.13,17.08 2.13,18.62 P1.11 2.13,20.66 2.13,38.62 P1.1 ; 45.82,33.45 44.78,32.42 42.71,32.42 C15.2 39.53,31.52 ; 33.21,18.32 33.21,20.85 34.62,22.26 39.78,22.26 39.91,22.12 ; 33.21,18.32 35.45,18.32 R12.1 ; 36.42,46.94 38.01,45.35 C12.2 37.27,43.61 v1(37.27,41.44) ; 60.07,13.93 60.07,12.91 57.41,10.25 57.41,8.98 56.51,8.08 55.89,8.08 ; 52.15,35.85 R47.1 53.05,39.74 53.05,40.76 ; 52.15,35.85 53.79,35.85 R40.1 ; 39.91,22.12 40.12,21.92 ; 39.91,22.12 39.91,24.25 40.13,24.46 40.13,25.9 36.89,29.13 ; v1(42.33,6.46) 42.34,6.47 C5.1 40.54,7.23 40.14,7.63 ; 53.05,40.76 53.05,43.62 52.24,44.43 ; 53.05,40.76 58.73,40.76 ; 40.14,7.63 40.13,7.64 ; v1(37.52,39.67) 38.03,39.16 R43.1 39.51,37.43 R33.1 R34.1 39.53,34.16 39.53,31.52 ; R36.1 52.24,45.97 52.24,44.43 ; 36.89,29.13 R45.1 ; 36.89,29.13 36.89,29.64 38.77,31.52 39.53,31.52 ; 52.24,44.43 C14.2 ; LED2.2 47.3,19.88 R54.1 47.3,11.45 v1(47.47,11.28) 45.7,9.5 45.7,6.71 46.2,6.2 52.03,6.2 54.3,8.47 54.68,8.08 55.89,8.08
  Bottom Layer w0.254: 37.3,41.41 29.62,41.41 P.14 ; 37.3,41.41 37.52,41.19 v1(37.52,39.67) ; 37.3,41.41 v1(37.27,41.44) ; v1(47.47,11.28) C22.2 44.18,6.46 v1(42.33,6.46)
VCC: length 78.7
  Top Layer w0.254: 68.68,21.24 69.35,21.91 69.79,21.91 ; 68.68,21.24 68.46,21.02 68.46,18.22 67.86,17.62 ; 68.68,21.24 68.68,22 66.52,24.16 U14.4 ; 61.75,40.76 U10.1 ; 61.75,40.76 67.98,40.76 69.75,38.99 K1.1 69.79,25.81 69.79,21.91 ; 61.75,40.76 61.75,41.86 TP9.1 ; 69.79,21.91 70.17,21.91 71.07,21.02 71.07,14.7 65.73,9.36 CN2.2 60.91,7.2 57.25,3.54
VCC_P: length 33.4
  Top Layer w0.254: 42.44,11.78 44.26,9.96 D8.1 42.99,8.67 ; 42.99,8.67 43.69,7.97 43.69,5.93 ; 42.99,8.67 42.94,8.63 C5.2 ; 56.51,12.75 U15.3 ; 56.51,12.75 57.15,12.75 D10.1 ; 56.51,12.75 C20.2 56.03,9 v1(55.3,9) ; 43.69,5.93 D6.1 ; 43.69,5.93 43.95,5.68 54.59,5.68 v1(54.62,5.71)
  Bottom Layer w0.254: v1(54.62,5.71) 54.62,8.33 v1(55.3,9)
CAMARA_VCC: length 27.2
  Top Layer w0.254: v1(57.46,39.73) 58.73,38.46 U10.6 ; v1(61.27,45.32) 61.52,45.57 63.81,45.57 TP14.1
  Bottom Layer w0.254: v1(57.46,39.73) 57.21,39.99 57.21,41.26 v1(61.27,45.32) ; K1.4 60.25,27.75 60.25,36.24 U10.6
DIO2: length 21.6
  Top Layer w0.254: 33.76,42.07 31.96,40.27 31.96,36.33 P.10 ; 33.76,42.07 v1(36.61,42.07) ; 33.76,42.07 33.72,42.07 TP1.1 ; R20.1 39.41,42.47 39.41,43.14 ; C12.1 v1(39.41,43.21) 39.41,43.14 ; 39.41,43.14 42.4,43.14 42.51,43.25
  Bottom Layer w0.254: v1(39.41,43.21) 37.76,43.21 v1(36.61,42.07)
DIO3: length 37.1
  Top Layer w0.254: 42.24,45.72 R25.1 ; 42.24,45.72 42.55,46.03 ; 42.24,45.72 42.24,45.21 43.76,43.68 43.76,42.92 43.44,42.6 42.51,42.6 ; C13.1 45.61,46.39 42.91,46.39 42.55,46.03 ; 42.55,46.03 40.27,48.32 35.69,48.32 34.8,47.42 34.8,45.39 TP6.1 31.02,41.62 31.02,36.42 v1(31.05,36.4)
  Bottom Layer w0.254: v1(31.05,36.4) 31.05,33.42 P.9
DIO4: length 43.3
  Top Layer w0.254: TP5.1 36.47,37.01 v1(37.69,37.01) ; 50.77,42.59 50.81,42.63 C14.1 ; 50.77,42.59 48.12,42.59 U8.13 48.09,42.59 v1(46.8,42.59) ; 50.77,42.59 R26.1 ; P.3 31.82,22.2 v1(31.82,27.31)
  Bottom Layer w0.254: 37.76,37.08 37.76,33.24 v1(31.82,27.31) ; 37.76,37.08 v1(37.69,37.01) ; 37.76,37.08 40.59,39.91 44.12,39.91 v1(46.8,42.59)
DIO5: length 28.1
  Top Layer w0.254: v1(39.15,30.82) 39.41,30.57 43.22,30.57 ; 34.44,31.72 35.34,30.82 37.12,30.82 v1(37.88,31.58) ; 34.44,31.72 33.34,31.72 P.7 ; 34.44,31.72 34.44,36.79 TP2.1 ; C15.1 43.22,30.57 ; 43.22,30.57 43.22,29.68 R30.1 44.16,28.73 46.29,28.73 U9.13
  Bottom Layer w0.254: v1(37.88,31.58) 38.64,30.82 v1(39.15,30.82)
DIO13: length 47.8
  Top Layer w0.254: v1(44.95,24.12) 46.11,24.12 R51.1
  Bottom Layer w0.254: P1.3 4.04,34.74 6.58,34.74 14.66,26.66 42.41,26.66 v1(44.95,24.12)
SENSOR1: length 34
  Top Layer w0.254: R34.2 41.45,35.2 41.45,38.3 42.51,39.35 42.51,39.1 v1(42.76,38.84) ; 63.28,43.91 62.99,44.2 61.26,44.2 59.46,45.99 TP10.1 57.73,48.24 52.41,48.24 51.67,47.5 51.67,46.23 50.77,45.33 50.26,45.33 49.36,44.43 v1(49.36,44.18)
  Bottom Layer w0.254: v1(49.36,44.18) 44.03,38.84 v1(42.76,38.84)
SENSOR2: length 50.7
  Top Layer w0.254: 61.92,46.68 TP11.1 ; 61.92,46.68 62.68,47.45 v1(65.22,47.45) ; 61.92,46.68 59.9,48.7 52.15,48.7 50.37,46.93 ; v1(47.95,44.01) 47.95,44.13 50.37,46.55 50.37,46.93 ; 50.37,46.93 R36.2 ; U10.9 63.53,28.95 63.53,33.85 v1(68.63,38.95) ; 42.51,40.65 43.97,40.65 v1(45.29,41.97)
  Bottom Layer w0.254: v1(68.63,38.95) 68.63,44.8 65.98,47.45 v1(65.22,47.45) ; v1(45.29,41.97) 47.32,44.01 v1(47.95,44.01)
SENSOR3: length 40.1
  Top Layer w0.254: v1(49.48,41.3) U8.11 46.9,41.3 45.33,39.73 R41.2 ; v1(65.72,46.11) 66.99,46.11 TP12.1
  Bottom Layer w0.254: v1(65.72,46.11) 62.04,42.44 61.28,42.44 60.38,41.54 60.38,40.53 59.01,39.16 58,39.16 55.3,36.46 55.3,35.19 ; 55.3,35.19 49.48,41.02 v1(49.48,41.3) ; 55.3,35.19 58.73,31.77
SENSOR4: length 63.3
  Top Layer w0.254: 50.63,26.95 50.63,23.19 50.38,22.93 44.09,22.93 R1.2 ; 50.63,26.95 53.68,26.95 57.24,30.51 57.24,33.27 58.63,34.66 ; 50.63,26.95 47.59,30 U9.11 ; 58.63,34.66 U10.7 ; 58.63,34.66 58.63,35.37 60.15,36.9 60.15,41.98 56.09,46.04 56.09,47.01 56.6,47.52 57.36,47.52 58.26,46.62 58.26,46.37 62.44,42.18 65.69,42.18 TP13.1
$1N9776: length 9.8
  Top Layer w0.254: 40.16,40 40.16,39.53 R43.2 ; 40.16,40 43.74,40 43.99,39.75 43.99,38.25 R33.2 ; 40.16,40 R42.1
$1N10309: length 21.1
  Top Layer w0.254: v1(41.16,41.1) 41.36,41.3 42.51,41.3 ; v1(35.41,36.2) 35.26,36.06 35.26,35.97 34.87,35.58 34.87,34.46 35.93,33.41 35.95,33.41 35.95,31.59 ; v1(41.05,44.15) 40.28,44.92 40.28,46.04 R35.2
  Bottom Layer w0.254: 41.16,41.16 41.05,41.27 v1(41.05,44.15) ; 41.16,41.16 v1(41.16,41.1) ; 41.16,41.16 40.9,41.16 36.41,36.67 35.88,36.67 v1(35.41,36.2)
$1N10678: length 7.4
  Top Layer w0.254: 50.65,40.56 R47.2 50.87,38.62 50.87,35.89 ; 50.65,40.56 48.2,40.56 U8.10 ; 50.65,40.56 50.65,40.59 R46.1
$1N11010: length 18.6
  Top Layer w0.254: v1(44.69,29.51) 44.69,30.05 45.29,30.65 47.59,30.65 49.44,32.5 52.92,32.5 53.82,31.61 53.82,31.35 R49.2 ; R39.2 43.08,27.43 R48.1 44.51,27.69 v1(44.65,27.83)
  Bottom Layer w0.254: v1(44.69,29.51) 44.65,29.47 v1(44.65,27.83)
$2N484: length 14.5
  Top Layer w0.254: 35.46,15.81 37.84,13.43 37.84,11.78 37.77,11.71 R10.1 ; 35.46,15.81 D9.2 ; 35.46,15.81 36.73,17.08 36.73,20.01 35.52,21.21
$2N770: length 10.9
  Top Layer w0.254: LED1.1 65.32,14.72 68.11,14.72 68.88,15.49 68.88,16.25 68.37,16.76 66.49,16.76 R19.2
$2N3060: length 2.3
  Top Layer w0.254: R51.2 49.19,24.08 U14.1
$2N3062: length 2
  Top Layer w0.254: Q3.1 65.96,15.95
$2N3068: length 9.1
  Top Layer w0.254: R50.1 64.06,15.94 58.37,21.62
$2N3229: length 2.8
  Top Layer w0.254: LED2.1 48.76,22.13 49.27,21.62
$2N3351: length 6
  Top Layer w0.254: Q3.3 70.2,15.08 D7.2 69.75,18.07 K1.8
$2N4261: length 3.4
  Top Layer w0.254: D6.2 52.25,3.54
$2N4985: length 12.8
  Top Layer w0.254: 51.61,9.65 R52.1 ; 51.61,9.65 49.44,9.65 D11.2 ; 51.61,9.65 51.61,9.97 51.89,10.24 U15.1 51.89,13.29 R54.2
